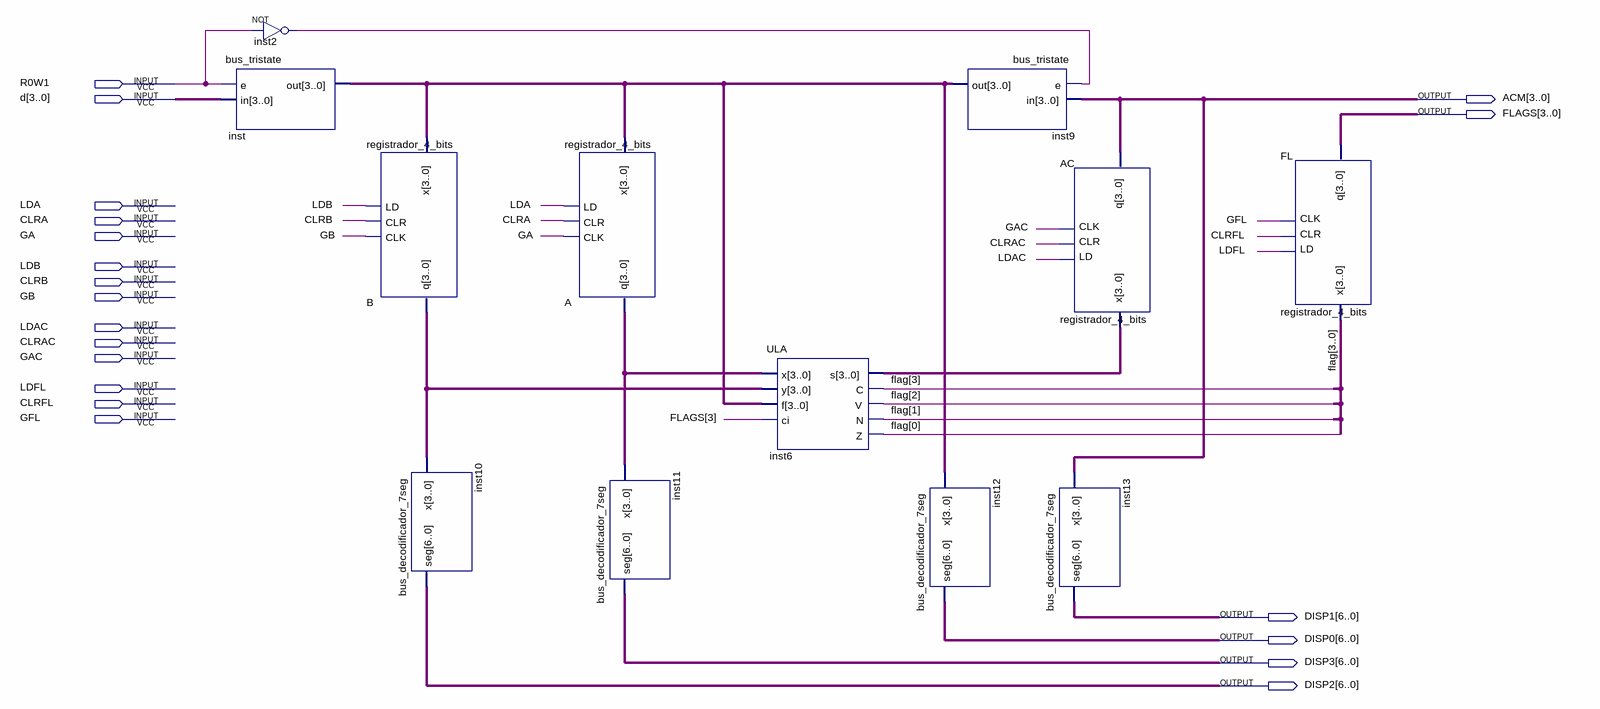
[diagram p0: schematic sheet]
// Quartus schematic bus_ula.bdf as structural Verilog: 12 symbols, 20 pins
module bus_ula (
  input  R0W1,
  input  [3:0] d,
  input  LDA,
  input  CLRA,
  input  GA,
  input  LDB,
  input  CLRB,
  input  GB,
  input  LDAC,
  input  CLRAC,
  input  GAC,
  input  LDFL,
  input  CLRFL,
  input  GFL,
  output [3:0] ACM,
  output [3:0] FLAGS,
  output [6:0] DISP1,
  output [6:0] DISP0,
  output [6:0] DISP3,
  output [6:0] DISP2
);

  wire inst2_out;
  wire [3:0] A_q, B_q, flag, inst6_s, inst_out;

  bus_tristate inst (.e(R0W1), .in(d), .out(inst_out));
  not inst2 (inst2_out, R0W1);
  registrador_4_bits B (.x(inst_out), .LD(LDB), .CLR(CLRB), .CLK(GB), .q(B_q));
  bus_decodificador_7seg inst10 (.x(B_q), .seg(DISP2));
  registrador_4_bits A (.x(inst_out), .LD(LDA), .CLR(CLRA), .CLK(GA), .q(A_q));
  bus_decodificador_7seg inst11 (.x(A_q), .seg(DISP3));
  ULA inst6 (
    .x(A_q), .y(B_q), .f(inst_out), .ci(FLAGS[3]), .s(inst6_s), .C(flag[3]), .V(flag[2]), .N(flag[1]),
    .Z(flag[0]));
  bus_decodificador_7seg inst12 (.x(inst_out), .seg(DISP0));
  bus_tristate inst9 (.e(inst2_out), .in(ACM), .out(inst_out));
  registrador_4_bits AC (.x(inst6_s), .LD(LDAC), .CLR(CLRAC), .CLK(GAC), .q(ACM));
  bus_decodificador_7seg inst13 (.x(ACM), .seg(DISP1));
  registrador_4_bits FL (.x(flag), .LD(LDFL), .CLR(CLRFL), .CLK(GFL), .q(FLAGS));
endmodule
